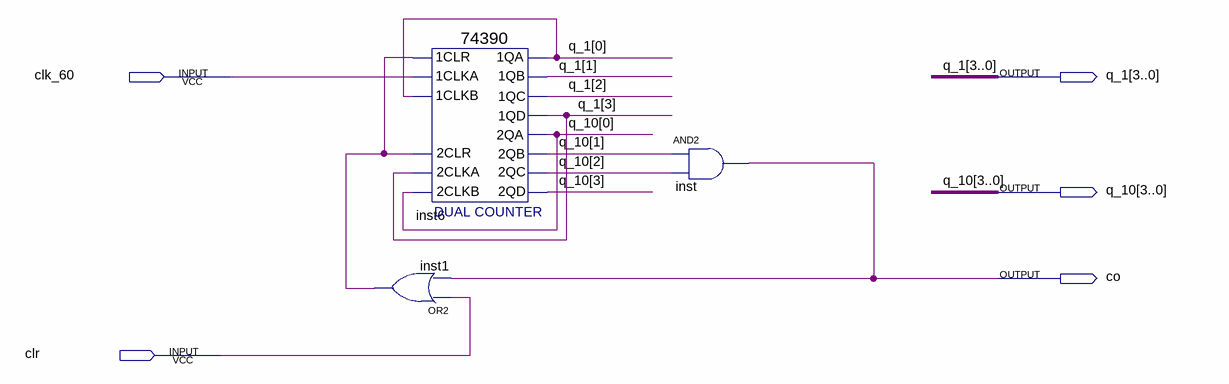
[diagram p0: schematic sheet]
// Quartus schematic cnt60.bdf as structural Verilog: 3 symbols, 5 pins
module cnt60 (
  input  clk_60,
  input  clr,
  output [3:0] q_1,
  output [3:0] q_10,
  output co
);

  wire inst1_out;

  or inst1 (inst1_out, clr, co);
  \74390  inst6 (
    .\2CLKA (q_1[3]), .\2CLR (inst1_out), .\2CLKB (q_10[0]), .\1CLR (inst1_out), .\1CLKA (clk_60),
    .\1CLKB (q_1[0]), .\1QA (q_1[0]), .\1QB (q_1[1]), .\1QC (q_1[2]), .\1QD (q_1[3]), .\2QA (q_10[0]),
    .\2QB (q_10[1]), .\2QC (q_10[2]), .\2QD (q_10[3]));
  and inst (co, q_10[1], q_10[2]);
endmodule
